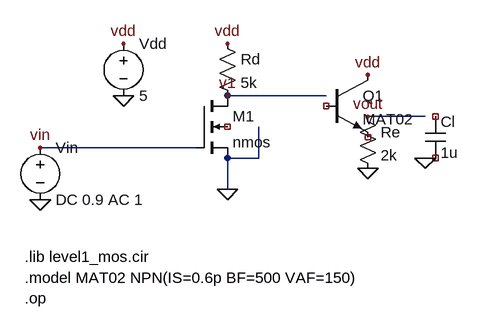
[diagram p0: schematic Assignment3_op.asc]
Assignment3_op.asc, the LTspice schematic file:
Version 4
SHEET 1 1000 680
WIRE 80 192 320 192
WIRE 368 112 520 112
WIRE 416 160 416 208
WIRE 368 208 416 208
WIRE 368 208 368 256
WIRE 584 144 672 144
FLAG 80 192 vin
FLAG 80 272 0
FLAG 208 32 vdd
FLAG 208 112 0
FLAG 368 32 vdd
FLAG 368 256 0
FLAG 584 80 vdd
FLAG 584 144 vout
FLAG 584 224 0
FLAG 672 208 0
FLAG 368 112 v1
SYMBOL voltage 80 176 R0
WINDOW 123 24 124 Left 2
WINDOW 39 0 0 Left 2
SYMATTR InstName Vin
SYMATTR Value DC 0.9 AC 1
SYMBOL voltage 208 16 R0
SYMATTR InstName Vdd
SYMATTR Value 5
SYMBOL res 352 16 R0
SYMATTR InstName Rd
SYMATTR Value 5k
SYMBOL nmos4 320 112 R0
SYMATTR InstName M1
SYMATTR Value nmos
SYMATTR Value2 l=1u w=100u
SYMBOL npn 520 80 R0
SYMATTR InstName Q1
SYMATTR Value MAT02
SYMBOL res 568 128 R0
SYMATTR InstName Re
SYMATTR Value 2k
SYMBOL cap 672 144 R0
SYMATTR InstName Cl
SYMATTR Value 1u
TEXT 56 360 Left 2 !.lib level1_mos.cir
TEXT 56 392 Left 2 !.model MAT02 NPN(IS=0.6p BF=500 VAF=150)
TEXT 56 424 Left 2 !.op

The netlist it stands for:
* Assignment3_op.asc
Vin vin 0 DC 0.9 AC 1
Vdd vdd 0 5
Rd vdd v1 5k
M1 v1 vin 0 NC_01 nmos l=1u w=100u
* Q1: MAT02 (symbol npn not certain, pin order unknown); nets seen at it: 0, vdd
Re vout 0 2k
Cl NC_04 NC_05 1u
.model NMOS NMOS
.model PMOS PMOS
.lib standard.mos
.lib level1_mos.cir
.model MAT02 NPN(IS=0.6p BF=500 VAF=150)
.op
.backanno
.end